# Altium schematic sheet Simple_MacroPad_PCB.SchDoc
size A4; SheetNumber: 1; SheetTotal: 1
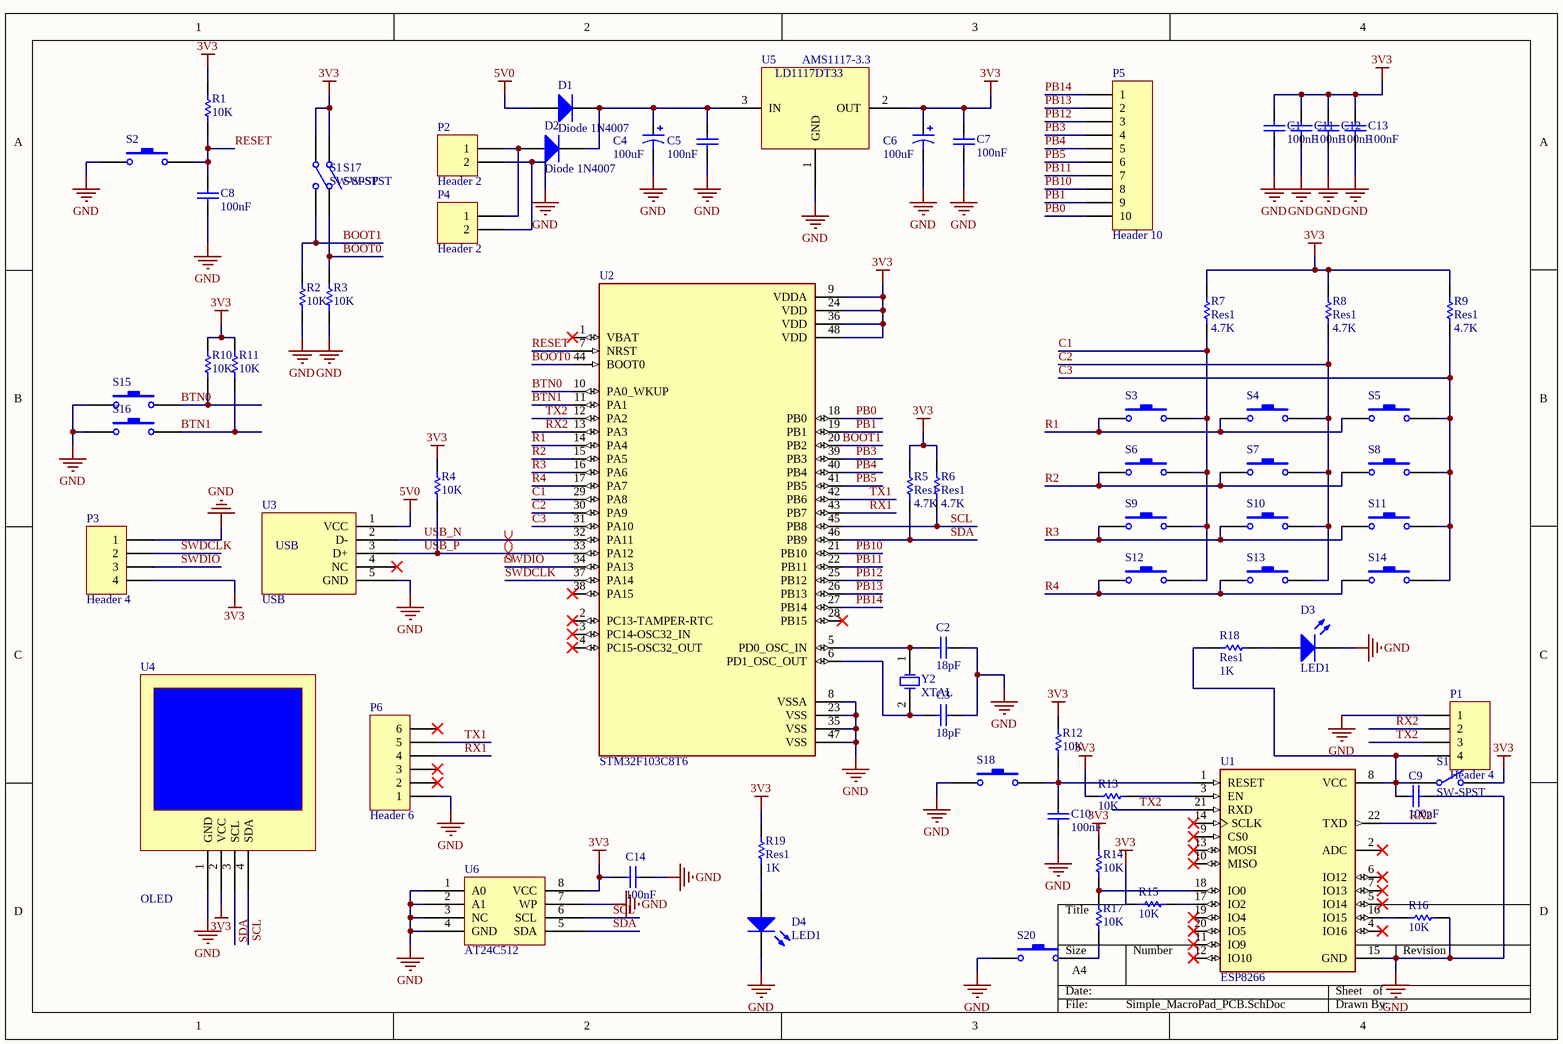
[diagram p0: Simple_MacroPad_PCB.SchDoc]

## Parts
C1  100nF  [CAP_1206]
C2  18pF  [CAP_1206]
C3  18pF  [CAP_1206]
C4  100uF  [CAP_TANTAL]
C5  100nF  [CAP_1206]
C6  100uF  [CAP_TANTAL]
C7  100nF  [CAP_1206]
C8  100nF  [CAP_1206]
C9  value 100nF  [CAP_1206]  (hidden comment: 18pF)
C10  value 100nF  [CAP_1206]  (hidden comment: 18pF)
C11  100nF  [CAP_1206]
C12  100nF  [CAP_1206]
C13  100nF  [CAP_1206]
C14  100nF  [CAP_1206]
D1  Diode 1N4007  [DIODE]
D2  Diode 1N4007  [DIODE]
D3  LED1  [LED_1206]
D4  LED1  [LED_1206]
P1  Header 4  [HDR1X4]
P2  Header 2  [JACK]
P3  Header 4  [HDR1X4]
P4  Header 2  [HDR1X2]
P5  Header 10  [HEADER10]
P6  Header 6  [HEADER6]
R1  10K  [RES_1206]
R2  10K  [RES_1206]
R3  10K  [RES_1206]
R4  value 10K  [RES_1206]  (hidden comment: 1.5K)
R5  Res1  value 4.7K  [RES_1206]
R6  Res1  value 4.7K  [RES_1206]
R7  Res1  value 4.7K  [RES_1206]
R8  Res1  value 4.7K  [RES_1206]
R9  Res1  value 4.7K  [RES_1206]
R10  10K  [RES_1206]
R11  10K  [RES_1206]
R12  10K  [RES_1206]
R13  10K  [RES_1206]
R14  10K  [RES_1206]
R15  10K  [RES_1206]
R16  10K  [RES_1206]
R17  10K  [RES_1206]
R18  Res1  value 1K  [RES_1206]
R19  Res1  value 1K  [RES_1206]
S1  SW-SPST  [SW_DIP1]
S2  PB  [BUTTON]  (value not drawn)
S3  PB  [BUTTON]  (value not drawn)
S4  PB  [BUTTON]  (value not drawn)
S5  PB  [BUTTON]  (value not drawn)
S6  PB  [BUTTON]  (value not drawn)
S7  PB  [BUTTON]  (value not drawn)
S8  PB  [BUTTON]  (value not drawn)
S9  PB  [BUTTON]  (value not drawn)
S10  PB  [BUTTON]  (value not drawn)
S11  PB  [BUTTON]  (value not drawn)
S12  PB  [BUTTON]  (value not drawn)
S13  PB  [BUTTON]  (value not drawn)
S14  PB  [BUTTON]  (value not drawn)
S15  PB  [BUTTON]  (value not drawn)
S16  PB  [BUTTON]  (value not drawn)
S17  SW-SPST  [SW_DIP1]
S18  PB  [BUTTON]  (value not drawn)
S19  SW-SPST  [SW_DIP1]
S20  PB  [BUTTON]  (value not drawn)
U1  ESP8266  [PCBComponent_1]
U2  STM32F103C8T6  [STM32f103C8T6]
U3  USB  [MICRO_USB]
U4  OLED  [OLED]
U5  AMS1117-3.3  [AMS1117]
U6  AT24C512  [AT24C512]
Y2  XTAL  [CRYSTAL]

## Nets
3V3: C1.2 C6.1 C7.2 C11.2 C12.2 C13.2 C14.2 P3.4 R1.2 R4.2 R5.2 R6.2 R7.2 R8.2 R9.2 R10.2 R11.2 R12.2 R13.2 R14.2 R15.2 R19.2 S1.1(COMMON) S17.1(COMMON) S19.2(NO) U2.9(VDDA) U2.24(VDD) U2.36(VDD) U2.48(VDD) U4.2(VCC) U5.2(OUT) U6.8(VCC)
5V0: D1.1(A) U3.1(VCC)
GND: C1.1 C2.1 C3.1 C4.2 C5.1 C6.2 C7.1 C8.1 C9.2 C10.2 C11.1 C12.1 C13.1 C14.1 D3.2(K) D4.2(K) P1.1 P2.2 P3.1 P4.2 P6.1 R2.1 R3.1 R16.1 S2.1 S15.1 S16.1 S18.1 S20.1 U1.15(GND) U2.8(VSSA) U2.23(VSS) U2.35(VSS) U2.47(VSS) U3.5(GND) U4.1(GND) U5.1(GND) U6.1(A0) U6.2(A1) U6.3(NC) U6.4(GND) U6.7(WP)
BOOT0: R3.2 S17.2(NO) U2.44(BOOT0)
BOOT1: R2.2 S1.2(NO) U2.20(PB2)
BTN0: R10.1 S15.2 U2.10(PA0_WKUP)
BTN1: R11.1 S16.2 U2.11(PA1)
C1: R7.1 S3.2 S6.2 S9.2 S12.2 U2.29(PA8)
C2: R8.1 S4.2 S7.2 S10.2 S13.2 U2.30(PA9)
C3: R9.1 S5.2 S8.2 S11.2 S14.2 U2.31(PA10)
PB0: P5.10 U2.18(PB0)
PB1: P5.9 U2.19(PB1)
PB3: P5.4 U2.39(PB3)
PB4: P5.5 U2.40(PB4)
PB5: P5.6 U2.41(PB5)
PB10: P5.8 U2.21(PB10)
PB11: P5.7 U2.22(PB11)
PB12: P5.3 U2.25(PB12)
PB13: P5.2 U2.26(PB13)
PB14: P5.1 U2.27(PB14)
R1: S3.1 S4.1 S5.1 U2.14(PA4)
R2: S6.1 S7.1 S8.1 U2.15(PA5)
R3: S9.1 S10.1 S11.1 U2.16(PA6)
R4: S12.1 S13.1 S14.1 U2.17(PA7)
RESET: C8.2 R1.1 S2.2 U2.7(NRST)
RX1: P6.4 U2.43(PB7)
RX2: P1.2 U1.22(TXD) U2.13(PA3)
SCL: R6.1 U2.45(PB8) U4.4(SDA) U6.6(SCL)
SDA: R5.1 U2.46(PB9) U4.3(SCL) U6.5(SDA)
SWDCLK: P3.2 U2.37(PA14)
SWDIO: P3.3 U2.34(PA13)
TX1: P6.5 U2.42(PB6)
TX2: P1.3 U1.21(RXD) U2.12(PA2)
USB_N: U2.32(PA11) U3.2(D-)
USB_P: R4.1 U2.33(PA12) U3.3(D+)
NetC2_2: C2.2 U2.5(PD0_OSC_IN) Y2.1(OSC1)
NetC3_2: C3.2 U2.6(PD1_OSC_OUT) Y2.2(OSC2)
NetC4_1: C4.1 C5.2 D1.2(K) D2.2(K) U5.3(IN)
NetC9_1: C9.1 P1.4 R18.2 S19.1(COMMON) U1.8(VCC)
NetC10_1: C10.1 R12.1 S18.2 U1.1(RESET)
NetD2_1: D2.1(A) P2.1 P4.1
NetD3_1: D3.1(A) R18.1
NetD4_1: D4.1(A) R19.1
NetR13_1: R13.1 U1.3(EN)
NetR14_1: R14.1 R17.2 U1.18(IO0)
NetR15_1: R15.1 U1.17(IO2)
NetR16_2: R16.2 U1.16(IO15)
NetR17_1: R17.1 S20.2

Not connected (* = marked no-connect by the designer): P6 2* 3* 6*; U1 2(ADC)* 4(IO16)* 5(IO14)* 6(IO12)* 7(IO13)* 9(CS0)* 10(MISO)* 11(IO9)* 12(IO10)* 13(MOSI)* 14(SCLK)* 19(IO4)* 20(IO5)*; U2 1(VBAT)* 2(PC13-TAMPER-RTC)* 3(PC14-OSC32_IN)* 4(PC15-OSC32_OUT)* 28(PB15)* 38(PA15)*; U3 4(NC)*

## Layout directives
differential pair: USB_N, USB_P

## Library data of the parts
C1-C3 C5 C7-C14 = Cap: Capacitor; Published: 8-Jun-2000; LatestRevisionDate: 17-Jul-2002; LatestRevisionNote: Re-released for DXP Platform.; PackageReference: RAD-0.3; Publisher: Altium Limited
  C1 C5 C7 C8 C11-C14: Value: 100nF
  C2 C3: Value: 18pF
C4 C6 = Cap Pol1: Polarized Capacitor (Radial); Published: 8-Jun-2000; LatestRevisionDate: 17-Jul-2002; LatestRevisionNote: Re-released for DXP Platform.; PackageReference: RB7.6-15; Publisher: Altium Limited; Value: 100uF
D1 D2 = Diode 1N4007: 1 Amp General Purpose Rectifier; Published: 8-Jun-2000; LatestRevisionDate: 17-Jul-2002; LatestRevisionNote: Re-released for DXP Platform.; DatasheetVersion: 1998; PackageVersion: Aug-1999; PackageReference: DO-41; Publisher: Altium Limited; PackageDescription: Diode, Axial; Body 5.2 x 2.7 mm (LxDia. max), Lead Dia. 0.86 mm (max); Code_JEDEC: DO-204-AL; ComponentLink1Description: Manufacturer Link; ComponentLink1URL: http://www.fairchildsemi.com/; ComponentLink2Description: Datasheet; ComponentLink2URL: http://www.fairchildsemi.com/ds/1N%2F1N4001.pdf
D3 D4 = LED1: Typical RED GaAs LED; Published: 8-Jun-2000; LatestRevisionDate: 08-Jul-2005; LatestRevisionNote: Mech Layer 1 removed.; PackageReference: LED-1; Publisher: Altium Limited; PackageDescription: LED; 2 Leads
P1 P3 = Header 4: Header, 4-Pin; LatestRevisionDate: 17-Jul-2002; LatestRevisionNote: Re-released for DXP Platform.; Publisher: Altium Limited
P2 P4 = Header 2: Header, 2-Pin; LatestRevisionDate: 17-Jul-2002; LatestRevisionNote: Re-released for DXP Platform.; Publisher: Altium Limited
P5 = Header 10: Header, 10-Pin; LatestRevisionDate: 17-Jul-2002; LatestRevisionNote: Re-released for DXP Platform.; Publisher: Altium Limited
P6 = Header 6: Header, 6-Pin; LatestRevisionDate: 17-Jul-2002; LatestRevisionNote: Re-released for DXP Platform.; Publisher: Altium Limited
R1-R19 = Res1: Resistor; Published: 8-Jun-2000; LatestRevisionDate: 17-Jul-2002; LatestRevisionNote: Re-released for DXP Platform.; PackageReference: AXIAL-0.3; Publisher: Altium Limited
  R1-R3 R10-R17: Value: 10K
  R5-R9 R18 R19: PackageDescription: Axial Device, Thru-Hole; 2 Leads; 0.3 in Pin Spacing
S1 S17 S19 = SW-SPST: Single-Pole, Single-Throw Switch; Published: 24-Mar-1999; LatestRevisionDate: 17-Jul-2002; LatestRevisionNote: Re-released for DXP Platform.; PackageReference: SPST-2; Publisher: Altium Limited; PackageDescription: Switch; 2 Leads
S2-S16 S18 S20 = SW-PB: Switch; Published: 24-Mar-1999; LatestRevisionDate: 17-Jul-2002; LatestRevisionNote: Re-released for DXP Platform.; PackageReference: SPST-2; Publisher: Altium Limited
U5 = LD1117DT33
Y2 = XTAL: Crystal Oscillator; Published: 8-Jun-2000; LatestRevisionDate: 17-Jul-2002; LatestRevisionNote: Re-released for DXP Platform.; PackageReference: R38; Publisher: Altium Limited; PackageDescription: Crystal, Thru-Hole; 2 Leads; Body 3.1 x 8.2 mm (Dia.xH)